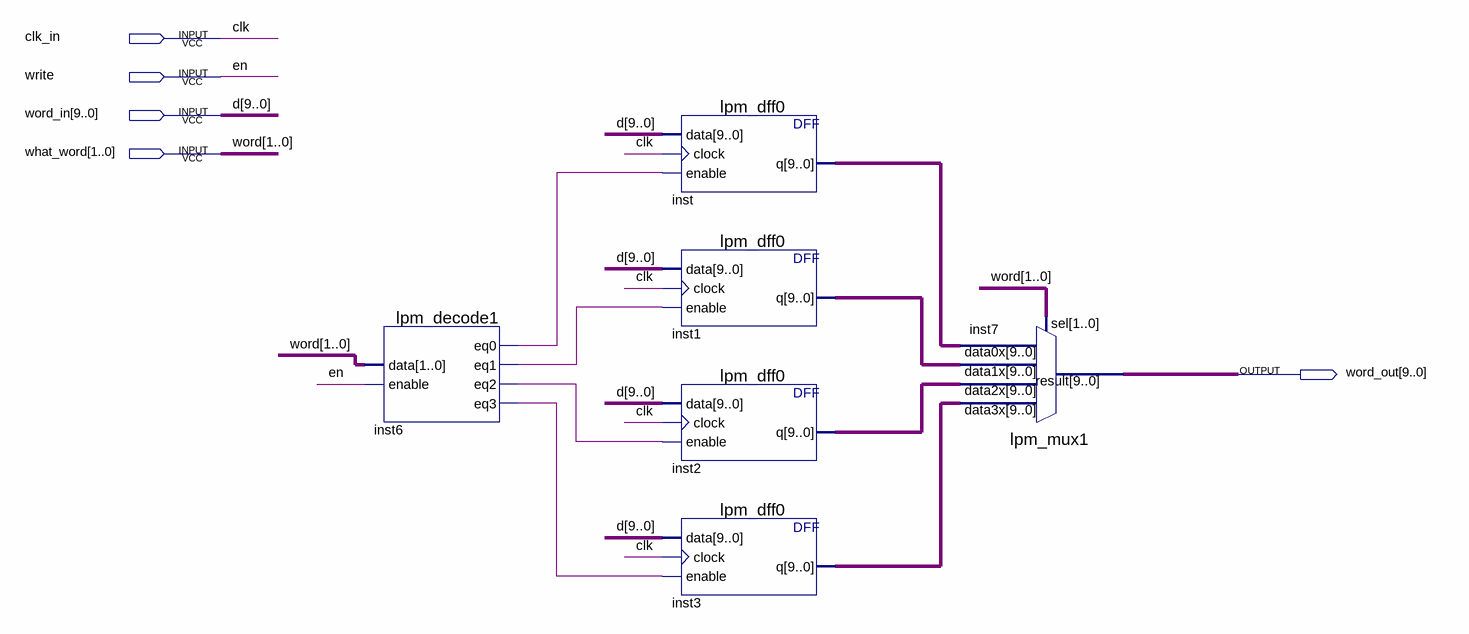
[diagram p0: schematic sheet]
// Quartus schematic String_cash.bdf as structural Verilog: 6 symbols, 5 pins
module String_cash (
  input  clk_in,
  input  write,
  input  [9:0] word_in,
  input  [1:0] what_word,
  output [9:0] word_out
);

  wire inst6_eq0, inst6_eq1, inst6_eq2, inst6_eq3;
  wire [9:0] inst1_q, inst2_q, inst3_q, inst_q;

  lpm_decode1 inst6 (
    .data(what_word), .enable(write), .eq0(inst6_eq0), .eq1(inst6_eq1), .eq2(inst6_eq2), .eq3(inst6_eq3));
  lpm_dff0 inst (.data(word_in), .clock(clk_in), .enable(inst6_eq0), .q(inst_q));
  lpm_dff0 inst1 (.data(word_in), .clock(clk_in), .enable(inst6_eq1), .q(inst1_q));
  lpm_dff0 inst2 (.data(word_in), .clock(clk_in), .enable(inst6_eq2), .q(inst2_q));
  lpm_dff0 inst3 (.data(word_in), .clock(clk_in), .enable(inst6_eq3), .q(inst3_q));
  lpm_mux1 inst7 (
    .data3x(inst3_q), .data2x(inst2_q), .data1x(inst1_q), .data0x(inst_q), .sel(what_word), .result(word_out));

  // Other names for the same wires on the sheet: clk = clk_in; d[9:0] = word_in; en = write; word[1:0] = what_word
endmodule
